# Altium schematic sheet connection_Sheet.SchDoc
size A
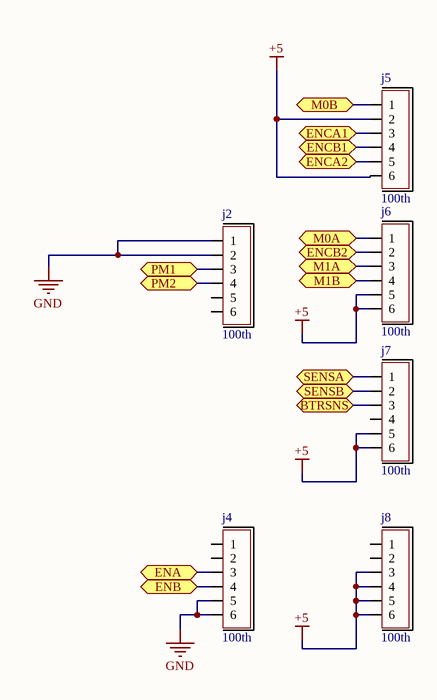
[diagram p0: connection_Sheet.SchDoc]

## Parts
j2  100th  [pin6header]
j4  100th  [pin6header]
j5  100th  [pin6header]
j6  100th  [pin6header]
j7  100th  [pin6header]
j8  100th  [pin6header]

## Ports
BTRSNS (bidir), ENA (bidir), ENB (bidir), ENCA1 (bidir), ENCA2 (bidir), ENCB1 (bidir), ENCB2 (bidir), M0A (bidir), M0B (bidir), M1A (bidir), M1B (bidir), PM1 (bidir), PM2 (bidir), SENSA (bidir), SENSB (bidir)

## Nets
+5: j5.2 j5.6 j6.5 j6.6 j7.5 j7.6 j8.3 j8.4 j8.5 j8.6
GND: j2.1 j2.2 j4.5 j4.6
BTRSNS: j7.3 ; port BTRSNS
ENA: j4.3 ; port ENA
ENB: j4.4 ; port ENB
ENCA1: j5.3 ; port ENCA1
ENCA2: j5.5 ; port ENCA2
ENCB1: j5.4 ; port ENCB1
ENCB2: j6.2 ; port ENCB2
M0A: j6.1 ; port M0A
M0B: j5.1 ; port M0B
M1A: j6.3 ; port M1A
M1B: j6.4 ; port M1B
PM1: j2.3 ; port PM1
PM2: j2.4 ; port PM2
SENSA: j7.1 ; port SENSA
SENSB: j7.2 ; port SENSB

Not connected (* = marked no-connect by the designer): j2 5 6; j4 1 2; j7 4; j8 1 2

## Library data of the parts
j2 j4-j8 = pin6header: System: Connector